# Altium schematic sheet 辉光钟_显示.SchDoc: 辉光钟
size A3; Date: 2016/12/31; CheckedBy: dudu; Author: dudu; Time: 2016/12/31; DocumentName: 辉光钟原理图
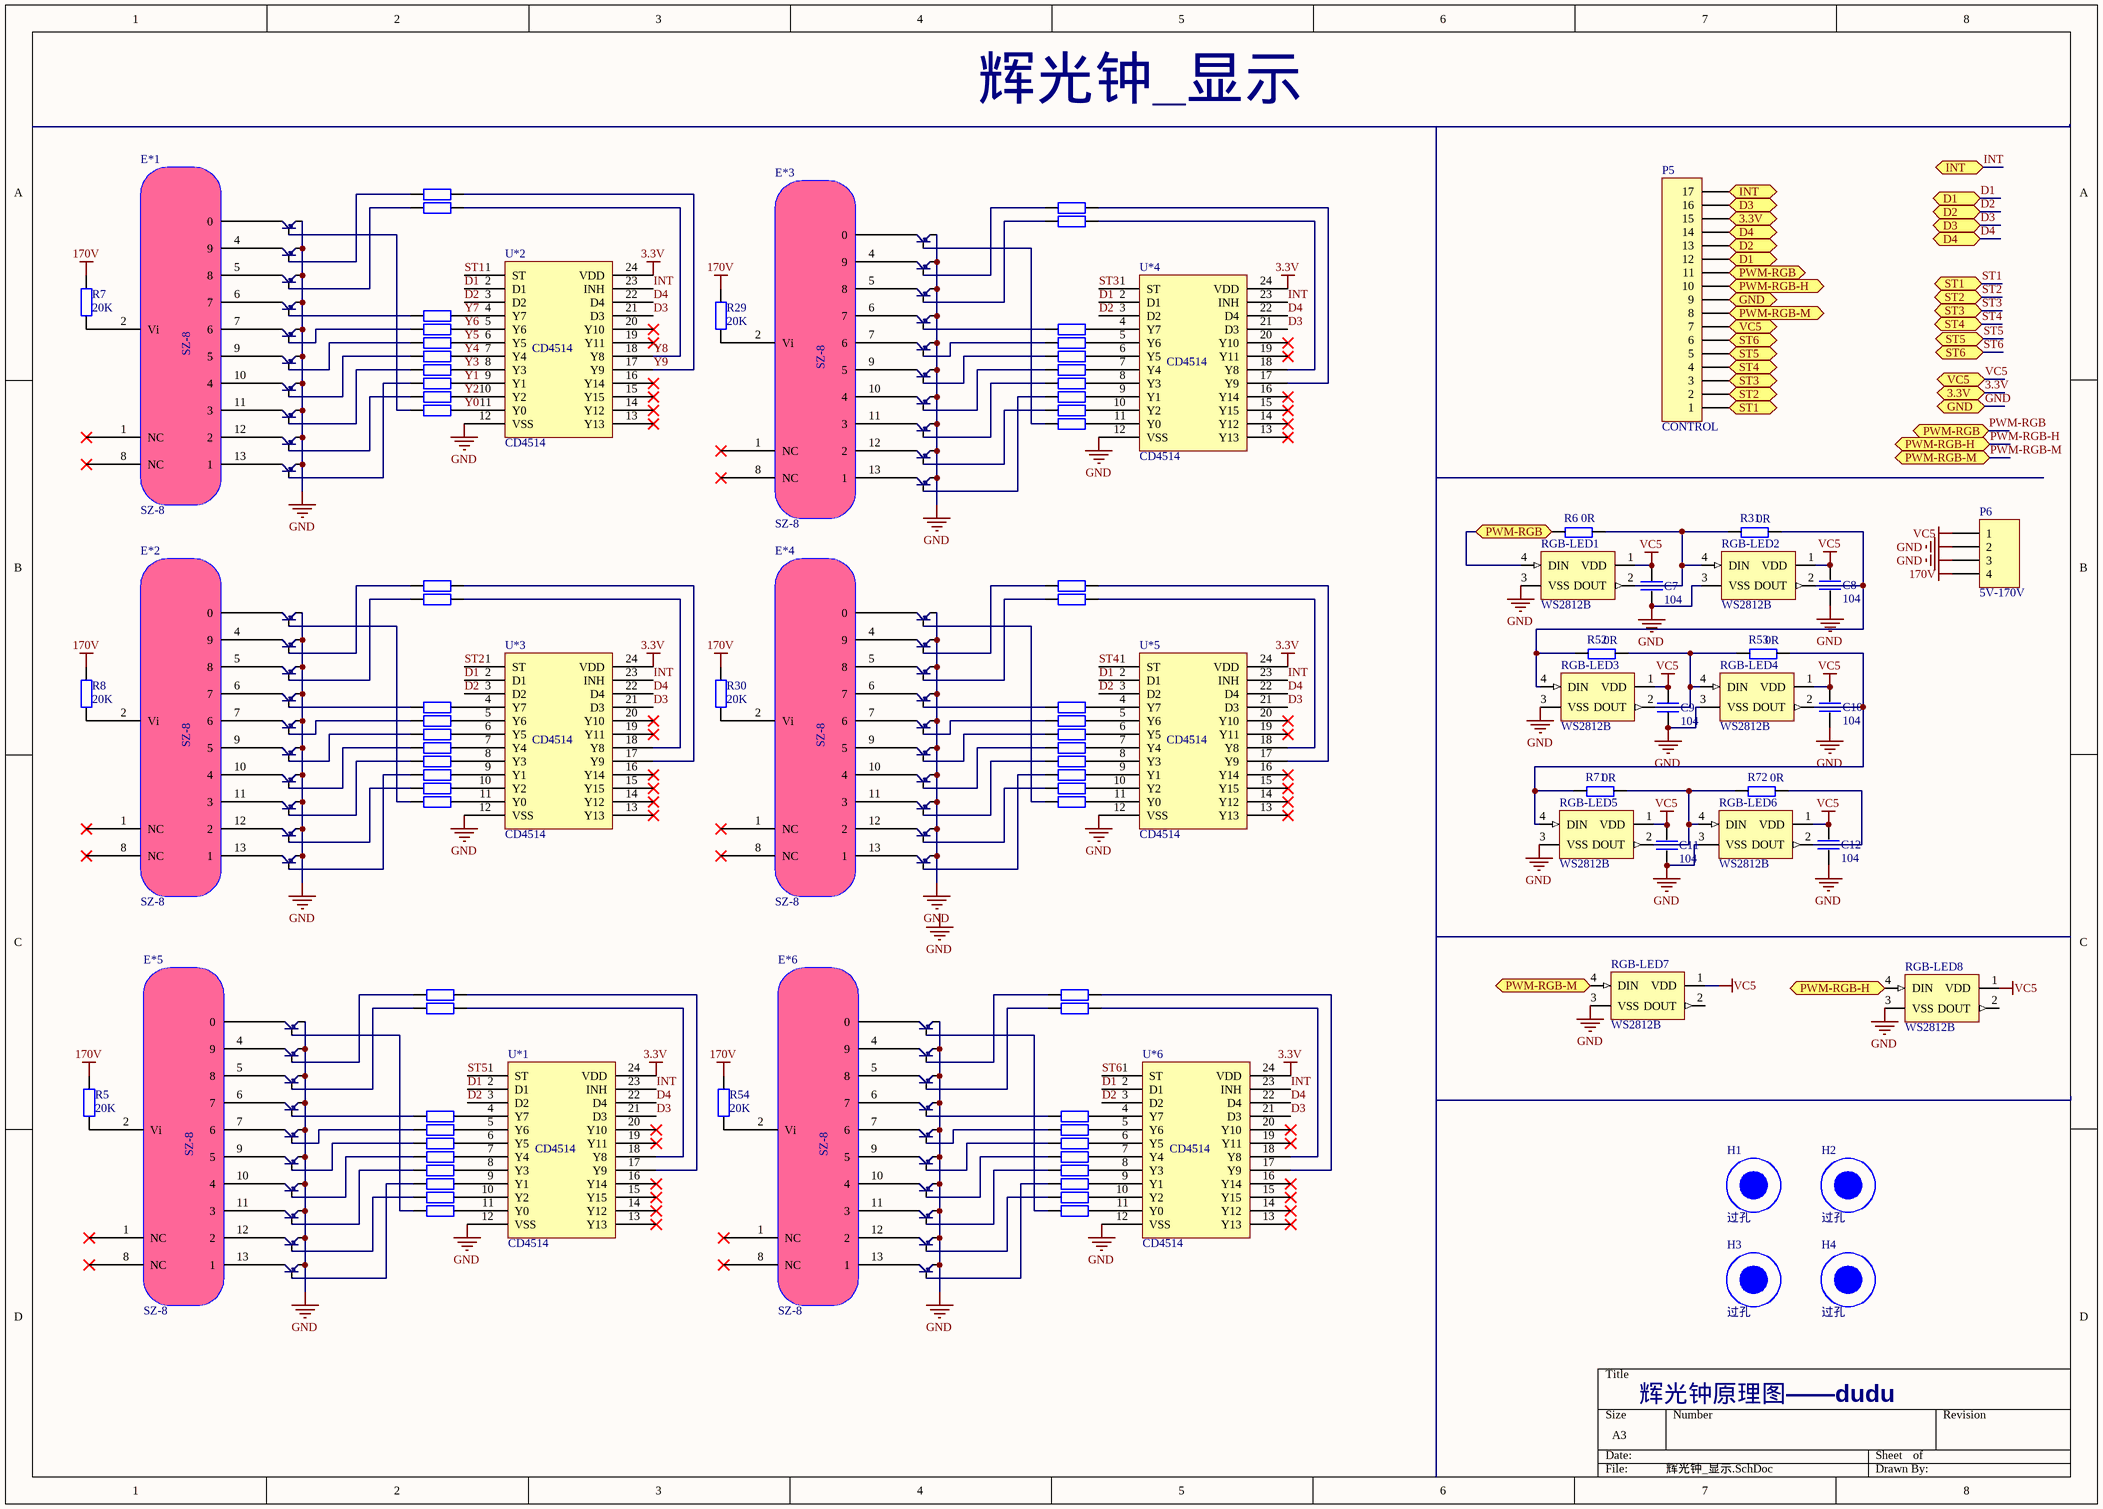
[diagram p0: 辉光钟_显示.SchDoc]

## Parts
C7  104  [0805C]
C8  104  [0805C]
C9  104  [0805C]
C10  104  [0805C]
C11  104  [0805C]
C12  104  [0805C]
E*1  SZ-8  [QS30]
E*2  SZ-8  [QS30]
E*3  SZ-8  [QS30]
E*4  SZ-8  [QS30]
E*5  SZ-8  [QS30]
E*6  SZ-8  [QS30]
H1  过孔  [定位孔]
H2  过孔  [定位孔]
H3  过孔  [定位孔]
H4  过孔  [定位孔]
NPN*1  NPN_mini  [NPN8050 SOT23R]  (value not drawn)
NPN*2  NPN_mini  [NPN8050 SOT23R]  (value not drawn)
NPN*3  NPN_mini  [NPN8050 SOT23R]  (value not drawn)
NPN*4  NPN_mini  [NPN8050 SOT23R]  (value not drawn)
NPN*5  NPN_mini  [NPN8050 SOT23R]  (value not drawn)
NPN*6  NPN_mini  [NPN8050 SOT23R]  (value not drawn)
NPN*7  NPN_mini  [NPN8050 SOT23R]  (value not drawn)
NPN*8  NPN_mini  [NPN8050 SOT23R]  (value not drawn)
NPN*9  NPN_mini  [NPN8050 SOT23R]  (value not drawn)
NPN*10  NPN_mini  [NPN8050 SOT23R]  (value not drawn)
NPN*11  NPN_mini  [NPN8050 SOT23R]  (value not drawn)
NPN*12  NPN_mini  [NPN8050 SOT23R]  (value not drawn)
NPN*13  NPN_mini  [NPN8050 SOT23R]  (value not drawn)
NPN*14  NPN_mini  [NPN8050 SOT23R]  (value not drawn)
NPN*15  NPN_mini  [NPN8050 SOT23R]  (value not drawn)
NPN*16  NPN_mini  [NPN8050 SOT23R]  (value not drawn)
NPN*17  NPN_mini  [NPN8050 SOT23R]  (value not drawn)
NPN*18  NPN_mini  [NPN8050 SOT23R]  (value not drawn)
NPN*19  NPN_mini  [NPN8050 SOT23R]  (value not drawn)
NPN*20  NPN_mini  [NPN8050 SOT23R]  (value not drawn)
NPN*21  NPN_mini  [NPN8050 SOT23R]  (value not drawn)
NPN*22  NPN_mini  [NPN8050 SOT23R]  (value not drawn)
NPN*23  NPN_mini  [NPN8050 SOT23R]  (value not drawn)
NPN*24  NPN_mini  [NPN8050 SOT23R]  (value not drawn)
NPN*25  NPN_mini  [NPN8050 SOT23R]  (value not drawn)
NPN*26  NPN_mini  [NPN8050 SOT23R]  (value not drawn)
NPN*27  NPN_mini  [NPN8050 SOT23R]  (value not drawn)
NPN*28  NPN_mini  [NPN8050 SOT23R]  (value not drawn)
NPN*29  NPN_mini  [NPN8050 SOT23R]  (value not drawn)
NPN*30  NPN_mini  [NPN8050 SOT23R]  (value not drawn)
NPN*31  NPN_mini  [NPN8050 SOT23R]  (value not drawn)
NPN*32  NPN_mini  [NPN8050 SOT23R]  (value not drawn)
NPN*33  NPN_mini  [NPN8050 SOT23R]  (value not drawn)
NPN*34  NPN_mini  [NPN8050 SOT23R]  (value not drawn)
NPN*35  NPN_mini  [NPN8050 SOT23R]  (value not drawn)
NPN*36  NPN_mini  [NPN8050 SOT23R]  (value not drawn)
NPN*37  NPN_mini  [NPN8050 SOT23R]  (value not drawn)
NPN*38  NPN_mini  [NPN8050 SOT23R]  (value not drawn)
NPN*39  NPN_mini  [NPN8050 SOT23R]  (value not drawn)
NPN*40  NPN_mini  [NPN8050 SOT23R]  (value not drawn)
NPN*41  NPN_mini  [NPN8050 SOT23R]  (value not drawn)
NPN*42  NPN_mini  [NPN8050 SOT23R]  (value not drawn)
NPN*43  NPN_mini  [NPN8050 SOT23R]  (value not drawn)
NPN*44  NPN_mini  [NPN8050 SOT23R]  (value not drawn)
NPN*45  NPN_mini  [NPN8050 SOT23R]  (value not drawn)
NPN*46  NPN_mini  [NPN8050 SOT23R]  (value not drawn)
NPN*47  NPN_mini  [NPN8050 SOT23R]  (value not drawn)
NPN*48  NPN_mini  [NPN8050 SOT23R]  (value not drawn)
NPN*49  NPN_mini  [NPN8050 SOT23R]  (value not drawn)
NPN*50  NPN_mini  [NPN8050 SOT23R]  (value not drawn)
NPN*51  NPN_mini  [NPN8050 SOT23R]  (value not drawn)
NPN*52  NPN_mini  [NPN8050 SOT23R]  (value not drawn)
NPN*53  NPN_mini  [NPN8050 SOT23R]  (value not drawn)
NPN*54  NPN_mini  [NPN8050 SOT23R]  (value not drawn)
NPN*55  NPN_mini  [NPN8050 SOT23R]  (value not drawn)
NPN*56  NPN_mini  [NPN8050 SOT23R]  (value not drawn)
NPN*57  NPN_mini  [NPN8050 SOT23R]  (value not drawn)
NPN*58  NPN_mini  [NPN8050 SOT23R]  (value not drawn)
NPN*59  NPN_mini  [NPN8050 SOT23R]  (value not drawn)
NPN*60  NPN_mini  [NPN8050 SOT23R]  (value not drawn)
P5  CONTROL  [LOCAT]
P6  5V-170V  [5V-170V]
R1  Res1  [0603R]  (value not drawn)
R2  Res1  [0603R]  (value not drawn)
R3  Res1  [0603R]  (value not drawn)
R4  Res1  [0603R]  (value not drawn)
R5  value 20K  [0603R]  (hidden comment: Res1)
R6  0R  [0603R]
R7  value 20K  [0603R]  (hidden comment: Res1)
R8  value 20K  [0603R]  (hidden comment: Res1)
R9  Res1  [0603R]  (value not drawn)
R10  Res1  [0603R]  (value not drawn)
R11  Res1  [0603R]  (value not drawn)
R12  Res1  [0603R]  (value not drawn)
R13  Res1  [0603R]  (value not drawn)
R14  Res1  [0603R]  (value not drawn)
R15  Res1  [0603R]  (value not drawn)
R16  Res1  [0603R]  (value not drawn)
R17  Res1  [0603R]  (value not drawn)
R18  Res1  [0603R]  (value not drawn)
R19  Res1  [0603R]  (value not drawn)
R20  Res1  [0603R]  (value not drawn)
R21  Res1  [0603R]  (value not drawn)
R22  Res1  [0603R]  (value not drawn)
R23  Res1  [0603R]  (value not drawn)
R24  Res1  [0603R]  (value not drawn)
R25  Res1  [0603R]  (value not drawn)
R26  Res1  [0603R]  (value not drawn)
R27  Res1  [0603R]  (value not drawn)
R28  Res1  [0603R]  (value not drawn)
R29  value 20K  [0603R]  (hidden comment: Res1)
R30  value 20K  [0603R]  (hidden comment: Res1)
R31  0R  [0603R]
R32  Res1  [0603R]  (value not drawn)
R33  Res1  [0603R]  (value not drawn)
R34  Res1  [0603R]  (value not drawn)
R35  Res1  [0603R]  (value not drawn)
R36  Res1  [0603R]  (value not drawn)
R37  Res1  [0603R]  (value not drawn)
R38  Res1  [0603R]  (value not drawn)
R39  Res1  [0603R]  (value not drawn)
R40  Res1  [0603R]  (value not drawn)
R41  Res1  [0603R]  (value not drawn)
R42  Res1  [0603R]  (value not drawn)
R43  Res1  [0603R]  (value not drawn)
R44  Res1  [0603R]  (value not drawn)
R45  Res1  [0603R]  (value not drawn)
R46  Res1  [0603R]  (value not drawn)
R47  Res1  [0603R]  (value not drawn)
R48  Res1  [0603R]  (value not drawn)
R49  Res1  [0603R]  (value not drawn)
R50  Res1  [0603R]  (value not drawn)
R51  Res1  [0603R]  (value not drawn)
R52  0R  [0603R]
R53  0R  [0603R]
R54  value 20K  [0603R]  (hidden comment: Res1)
R55  Res1  [0603R]  (value not drawn)
R56  Res1  [0603R]  (value not drawn)
R57  Res1  [0603R]  (value not drawn)
R58  Res1  [0603R]  (value not drawn)
R59  Res1  [0603R]  (value not drawn)
R60  Res1  [0603R]  (value not drawn)
R61  Res1  [0603R]  (value not drawn)
R62  Res1  [0603R]  (value not drawn)
R63  Res1  [0603R]  (value not drawn)
R64  Res1  [0603R]  (value not drawn)
R65  Res1  [0603R]  (value not drawn)
R66  Res1  [0603R]  (value not drawn)
R67  Res1  [0603R]  (value not drawn)
R68  Res1  [0603R]  (value not drawn)
R69  Res1  [0603R]  (value not drawn)
R70  Res1  [0603R]  (value not drawn)
R71  0R  [0603R]
R72  0R  [0603R]
RGB-LED1  WS2812B  [WS2812B]
RGB-LED2  WS2812B  [WS2812B]
RGB-LED3  WS2812B  [WS2812B]
RGB-LED4  WS2812B  [WS2812B]
RGB-LED5  WS2812B  [WS2812B]
RGB-LED6  WS2812B  [WS2812B]
RGB-LED7  WS2812B  [WS2812B]
RGB-LED8  WS2812B  [WS2812B]
U*1  CD4514  [SOP24]
U*2  CD4514  [SOP24]
U*3  CD4514  [SOP24]
U*4  CD4514  [SOP24]
U*5  CD4514  [SOP24]
U*6  CD4514  [SOP24]

## Ports
3.3V (bidir), D1 (bidir), D2 (bidir), D3 (bidir), D4 (bidir), GND (bidir), INT (bidir), PWM-RGB (bidir), PWM-RGB-H (bidir), PWM-RGB-M (bidir), ST1 (bidir), ST2 (bidir), ST3 (bidir), ST4 (bidir), ST5 (bidir), ST6 (bidir), VC5 (bidir)

## Nets
3.3V: P5.15 U*1.24(VDD) U*2.24(VDD) U*3.24(VDD) U*4.24(VDD) U*5.24(VDD) U*6.24(VDD) ; port 3.3V
170V: P6.4 R5.2 R7.2 R8.2 R29.2 R30.2 R54.2
GND: C7.1 C8.1 C9.1 C10.1 C11.1 C12.1 NPN*1.2(E) NPN*2.2(E) NPN*3.2(E) NPN*4.2(E) NPN*5.2(E) NPN*6.2(E) NPN*7.2(E) NPN*8.2(E) NPN*9.2(E) NPN*10.2(E) NPN*11.2(E) NPN*12.2(E) NPN*13.2(E) NPN*14.2(E) NPN*15.2(E) NPN*16.2(E) NPN*17.2(E) NPN*18.2(E) NPN*19.2(E) NPN*20.2(E) NPN*21.2(E) NPN*22.2(E) NPN*23.2(E) NPN*24.2(E) NPN*25.2(E) NPN*26.2(E) NPN*27.2(E) NPN*28.2(E) NPN*29.2(E) NPN*30.2(E) NPN*31.2(E) NPN*32.2(E) NPN*33.2(E) NPN*34.2(E) NPN*35.2(E) NPN*36.2(E) NPN*37.2(E) NPN*38.2(E) NPN*39.2(E) NPN*40.2(E) NPN*41.2(E) NPN*42.2(E) NPN*43.2(E) NPN*44.2(E) NPN*45.2(E) NPN*46.2(E) NPN*47.2(E) NPN*48.2(E) NPN*49.2(E) NPN*50.2(E) NPN*51.2(E) NPN*52.2(E) NPN*53.2(E) NPN*54.2(E) NPN*55.2(E) NPN*56.2(E) NPN*57.2(E) NPN*58.2(E) NPN*59.2(E) NPN*60.2(E) P5.9 P6.2 P6.3 RGB-LED1.3(VSS) RGB-LED2.3(VSS) RGB-LED3.3(VSS) RGB-LED4.3(VSS) RGB-LED5.3(VSS) RGB-LED6.3(VSS) RGB-LED7.3(VSS) RGB-LED8.3(VSS) U*1.12(VSS) U*2.12(VSS) U*3.12(VSS) U*4.12(VSS) U*5.12(VSS) U*6.12(VSS) ; port GND
VC5: C7.2 C8.2 C9.2 C10.2 C11.2 C12.2 P5.7 P6.1 RGB-LED1.1(VDD) RGB-LED2.1(VDD) RGB-LED3.1(VDD) RGB-LED4.1(VDD) RGB-LED5.1(VDD) RGB-LED6.1(VDD) RGB-LED7.1(VDD) RGB-LED8.1(VDD) ; port VC5
D1: P5.12 U*1.2(D1) U*2.2(D1) U*3.2(D1) U*4.2(D1) U*5.2(D1) U*6.2(D1) ; port D1
D2: P5.13 U*1.3(D2) U*2.3(D2) U*3.3(D2) U*4.3(D2) U*5.3(D2) U*6.3(D2) ; port D2
D3: P5.16 U*1.21(D3) U*2.21(D3) U*3.21(D3) U*4.21(D3) U*5.21(D3) U*6.21(D3) ; port D3
D4: P5.14 U*1.22(D4) U*2.22(D4) U*3.22(D4) U*4.22(D4) U*5.22(D4) U*6.22(D4) ; port D4
INT: P5.17 U*1.23(INH) U*2.23(INH) U*3.23(INH) U*4.23(INH) U*5.23(INH) U*6.23(INH) ; port INT
PWM-RGB: P5.11 R6.1 RGB-LED1.4(DIN) ; port PWM-RGB
PWM-RGB-H: P5.10 RGB-LED8.4(DIN) ; port PWM-RGB-H
PWM-RGB-M: P5.8 RGB-LED7.4(DIN) ; port PWM-RGB-M
ST1: P5.1 U*2.1(ST) ; port ST1
ST2: P5.2 U*3.1(ST) ; port ST2
ST3: P5.3 U*4.1(ST) ; port ST3
ST4: P5.4 U*5.1(ST) ; port ST4
ST5: P5.5 U*1.1(ST) ; port ST5
ST6: P5.6 U*6.1(ST) ; port ST6
Y0: R18.1 U*2.11(Y0)
Y1: R16.1 U*2.9(Y1)
Y2: R17.1 U*2.10(Y2)
Y3: R15.1 U*2.8(Y3)
Y4: R14.1 U*2.7(Y4)
Y5: R13.1 U*2.6(Y5)
Y6: R12.1 U*2.5(Y6)
Y7: R11.1 U*2.4(Y7)
Y8: R10.1 U*2.18(Y8)
Y9: R9.1 U*2.17(Y9)
NetE*1_2: E*1.2(Vi) R7.1
NetE*1_3: E*1.3(0) NPN*1.3(C)
NetE*1_4: E*1.4(9) NPN*2.3(C)
NetE*1_5: E*1.5(8) NPN*3.3(C)
NetE*1_6: E*1.6(7) NPN*4.3(C)
NetE*1_7: E*1.7(6) NPN*5.3(C)
NetE*1_9: E*1.9(5) NPN*6.3(C)
NetE*1_10: E*1.10(4) NPN*7.3(C)
NetE*1_11: E*1.11(3) NPN*8.3(C)
NetE*1_12: E*1.12(2) NPN*9.3(C)
NetE*1_13: E*1.13(1) NPN*10.3(C)
NetE*2_2: E*2.2(Vi) R8.1
NetE*2_3: E*2.3(0) NPN*11.3(C)
NetE*2_4: E*2.4(9) NPN*12.3(C)
NetE*2_5: E*2.5(8) NPN*13.3(C)
NetE*2_6: E*2.6(7) NPN*14.3(C)
NetE*2_7: E*2.7(6) NPN*15.3(C)
NetE*2_9: E*2.9(5) NPN*16.3(C)
NetE*2_10: E*2.10(4) NPN*17.3(C)
NetE*2_11: E*2.11(3) NPN*18.3(C)
NetE*2_12: E*2.12(2) NPN*19.3(C)
NetE*2_13: E*2.13(1) NPN*20.3(C)
NetE*3_2: E*3.2(Vi) R29.1
NetE*3_3: E*3.3(0) NPN*21.3(C)
NetE*3_4: E*3.4(9) NPN*22.3(C)
NetE*3_5: E*3.5(8) NPN*23.3(C)
NetE*3_6: E*3.6(7) NPN*24.3(C)
NetE*3_7: E*3.7(6) NPN*25.3(C)
NetE*3_9: E*3.9(5) NPN*26.3(C)
NetE*3_10: E*3.10(4) NPN*27.3(C)
NetE*3_11: E*3.11(3) NPN*28.3(C)
NetE*3_12: E*3.12(2) NPN*29.3(C)
NetE*3_13: E*3.13(1) NPN*30.3(C)
NetE*4_2: E*4.2(Vi) R30.1
NetE*4_3: E*4.3(0) NPN*31.3(C)
NetE*4_4: E*4.4(9) NPN*32.3(C)
NetE*4_5: E*4.5(8) NPN*33.3(C)
NetE*4_6: E*4.6(7) NPN*34.3(C)
NetE*4_7: E*4.7(6) NPN*35.3(C)
NetE*4_9: E*4.9(5) NPN*36.3(C)
NetE*4_10: E*4.10(4) NPN*37.3(C)
NetE*4_11: E*4.11(3) NPN*38.3(C)
NetE*4_12: E*4.12(2) NPN*39.3(C)
NetE*4_13: E*4.13(1) NPN*40.3(C)
NetE*5_2: E*5.2(Vi) R5.1
NetE*5_3: E*5.3(0) NPN*41.3(C)
NetE*5_4: E*5.4(9) NPN*43.3(C)
NetE*5_5: E*5.5(8) NPN*45.3(C)
NetE*5_6: E*5.6(7) NPN*47.3(C)
NetE*5_7: E*5.7(6) NPN*49.3(C)
NetE*5_9: E*5.9(5) NPN*51.3(C)
NetE*5_10: E*5.10(4) NPN*53.3(C)
NetE*5_11: E*5.11(3) NPN*55.3(C)
NetE*5_12: E*5.12(2) NPN*57.3(C)
NetE*5_13: E*5.13(1) NPN*59.3(C)
NetE*6_2: E*6.2(Vi) R54.1
NetE*6_3: E*6.3(0) NPN*42.3(C)
NetE*6_4: E*6.4(9) NPN*44.3(C)
NetE*6_5: E*6.5(8) NPN*46.3(C)
NetE*6_6: E*6.6(7) NPN*48.3(C)
NetE*6_7: E*6.7(6) NPN*50.3(C)
NetE*6_9: E*6.9(5) NPN*52.3(C)
NetE*6_10: E*6.10(4) NPN*54.3(C)
NetE*6_11: E*6.11(3) NPN*56.3(C)
NetE*6_12: E*6.12(2) NPN*58.3(C)
NetE*6_13: E*6.13(1) NPN*60.3(C)
NetNPN*1_1: NPN*1.1(B) R18.2
NetNPN*2_1: NPN*2.1(B) R9.2
NetNPN*3_1: NPN*3.1(B) R10.2
NetNPN*4_1: NPN*4.1(B) R11.2
NetNPN*5_1: NPN*5.1(B) R12.2
NetNPN*6_1: NPN*6.1(B) R13.2
NetNPN*7_1: NPN*7.1(B) R14.2
NetNPN*8_1: NPN*8.1(B) R15.2
NetNPN*9_1: NPN*9.1(B) R17.2
NetNPN*10_1: NPN*10.1(B) R16.2
NetNPN*11_1: NPN*11.1(B) R28.2
NetNPN*12_1: NPN*12.1(B) R19.2
NetNPN*13_1: NPN*13.1(B) R20.2
NetNPN*14_1: NPN*14.1(B) R21.2
NetNPN*15_1: NPN*15.1(B) R22.2
NetNPN*16_1: NPN*16.1(B) R23.2
NetNPN*17_1: NPN*17.1(B) R24.2
NetNPN*18_1: NPN*18.1(B) R25.2
NetNPN*19_1: NPN*19.1(B) R27.2
NetNPN*20_1: NPN*20.1(B) R26.2
NetNPN*21_1: NPN*21.1(B) R41.2
NetNPN*22_1: NPN*22.1(B) R32.2
NetNPN*23_1: NPN*23.1(B) R33.2
NetNPN*24_1: NPN*24.1(B) R34.2
NetNPN*25_1: NPN*25.1(B) R35.2
NetNPN*26_1: NPN*26.1(B) R36.2
NetNPN*27_1: NPN*27.1(B) R37.2
NetNPN*28_1: NPN*28.1(B) R38.2
NetNPN*29_1: NPN*29.1(B) R40.2
NetNPN*30_1: NPN*30.1(B) R39.2
NetNPN*31_1: NPN*31.1(B) R51.2
NetNPN*32_1: NPN*32.1(B) R42.2
NetNPN*33_1: NPN*33.1(B) R43.2
NetNPN*34_1: NPN*34.1(B) R44.2
NetNPN*35_1: NPN*35.1(B) R45.2
NetNPN*36_1: NPN*36.1(B) R46.2
NetNPN*37_1: NPN*37.1(B) R47.2
NetNPN*38_1: NPN*38.1(B) R48.2
NetNPN*39_1: NPN*39.1(B) R50.2
NetNPN*40_1: NPN*40.1(B) R49.2
NetNPN*41_1: NPN*41.1(B) R69.2
NetNPN*42_1: NPN*42.1(B) R70.2
NetNPN*43_1: NPN*43.1(B) R1.2
NetNPN*44_1: NPN*44.1(B) R2.2
NetNPN*45_1: NPN*45.1(B) R3.2
NetNPN*46_1: NPN*46.1(B) R4.2
NetNPN*47_1: NPN*47.1(B) R55.2
NetNPN*48_1: NPN*48.1(B) R56.2
NetNPN*49_1: NPN*49.1(B) R57.2
NetNPN*50_1: NPN*50.1(B) R58.2
NetNPN*51_1: NPN*51.1(B) R59.2
NetNPN*52_1: NPN*52.1(B) R60.2
NetNPN*53_1: NPN*53.1(B) R61.2
NetNPN*54_1: NPN*54.1(B) R62.2
NetNPN*55_1: NPN*55.1(B) R63.2
NetNPN*56_1: NPN*56.1(B) R64.2
NetNPN*57_1: NPN*57.1(B) R67.2
NetNPN*58_1: NPN*58.1(B) R68.2
NetNPN*59_1: NPN*59.1(B) R65.2
NetNPN*60_1: NPN*60.1(B) R66.2
NetR1_1: R1.1 U*1.17(Y9)
NetR2_1: R2.1 U*6.17(Y9)
NetR3_1: R3.1 U*1.18(Y8)
NetR4_1: R4.1 U*6.18(Y8)
NetR6_2: R6.2 R31.1 RGB-LED1.2(DOUT) RGB-LED2.4(DIN)
NetR19_1: R19.1 U*3.17(Y9)
NetR20_1: R20.1 U*3.18(Y8)
NetR21_1: R21.1 U*3.4(Y7)
NetR22_1: R22.1 U*3.5(Y6)
NetR23_1: R23.1 U*3.6(Y5)
NetR24_1: R24.1 U*3.7(Y4)
NetR25_1: R25.1 U*3.8(Y3)
NetR26_1: R26.1 U*3.9(Y1)
NetR27_1: R27.1 U*3.10(Y2)
NetR28_1: R28.1 U*3.11(Y0)
NetR31_2: R31.2 R52.1 RGB-LED2.2(DOUT) RGB-LED3.4(DIN)
NetR32_1: R32.1 U*4.17(Y9)
NetR33_1: R33.1 U*4.18(Y8)
NetR34_1: R34.1 U*4.4(Y7)
NetR35_1: R35.1 U*4.5(Y6)
NetR36_1: R36.1 U*4.6(Y5)
NetR37_1: R37.1 U*4.7(Y4)
NetR38_1: R38.1 U*4.8(Y3)
NetR39_1: R39.1 U*4.9(Y1)
NetR40_1: R40.1 U*4.10(Y2)
NetR41_1: R41.1 U*4.11(Y0)
NetR42_1: R42.1 U*5.17(Y9)
NetR43_1: R43.1 U*5.18(Y8)
NetR44_1: R44.1 U*5.4(Y7)
NetR45_1: R45.1 U*5.5(Y6)
NetR46_1: R46.1 U*5.6(Y5)
NetR47_1: R47.1 U*5.7(Y4)
NetR48_1: R48.1 U*5.8(Y3)
NetR49_1: R49.1 U*5.9(Y1)
NetR50_1: R50.1 U*5.10(Y2)
NetR51_1: R51.1 U*5.11(Y0)
NetR52_2: R52.2 R53.1 RGB-LED3.2(DOUT) RGB-LED4.4(DIN)
NetR53_2: R53.2 R71.1 RGB-LED4.2(DOUT) RGB-LED5.4(DIN)
NetR55_1: R55.1 U*1.4(Y7)
NetR56_1: R56.1 U*6.4(Y7)
NetR57_1: R57.1 U*1.5(Y6)
NetR58_1: R58.1 U*6.5(Y6)
NetR59_1: R59.1 U*1.6(Y5)
NetR60_1: R60.1 U*6.6(Y5)
NetR61_1: R61.1 U*1.7(Y4)
NetR62_1: R62.1 U*6.7(Y4)
NetR63_1: R63.1 U*1.8(Y3)
NetR64_1: R64.1 U*6.8(Y3)
NetR65_1: R65.1 U*1.9(Y1)
NetR66_1: R66.1 U*6.9(Y1)
NetR67_1: R67.1 U*1.10(Y2)
NetR68_1: R68.1 U*6.10(Y2)
NetR69_1: R69.1 U*1.11(Y0)
NetR70_1: R70.1 U*6.11(Y0)
NetR71_2: R71.2 R72.1 RGB-LED5.2(DOUT) RGB-LED6.4(DIN)
NetR72_2: R72.2 RGB-LED6.2(DOUT)

Not connected (* = marked no-connect by the designer): E*1 1(NC)* 8(NC)*; E*2 1(NC)* 8(NC)*; E*3 1(NC)* 8(NC)*; E*4 1(NC)* 8(NC)*; E*5 1(NC)* 8(NC)*; E*6 1(NC)* 8(NC)*; RGB-LED7 2(DOUT); RGB-LED8 2(DOUT); U*1 13(Y13)* 14(Y12)* 15(Y15)* 16(Y14)* 19(Y11)* 20(Y10)*; U*2 13(Y13)* 14(Y12)* 15(Y15)* 16(Y14)* 19(Y11)* 20(Y10)*; U*3 13(Y13)* 14(Y12)* 15(Y15)* 16(Y14)* 19(Y11)* 20(Y10)*; U*4 13(Y13)* 14(Y12)* 15(Y15)* 16(Y14)* 19(Y11)* 20(Y10)*; U*5 13(Y13)* 14(Y12)* 15(Y15)* 16(Y14)* 19(Y11)* 20(Y10)*; U*6 13(Y13)* 14(Y12)* 15(Y15)* 16(Y14)* 19(Y11)* 20(Y10)*

## Notes on the sheet
- 辉光钟_显示
- 辉光钟原理图——dudu
- Labels drawn without touching a wire or pin: GND

## Library data of the parts
C7-C12 = C
P5 = Header 17: Header, 17-Pin; LatestRevisionDate: 17-Jul-2002; LatestRevisionNote: Re-released for DXP Platform.; Publisher: Altium Limited
P6 = Header 4: Header, 4-Pin; LatestRevisionDate: 17-Jul-2002; LatestRevisionNote: Re-released for DXP Platform.; Publisher: Altium Limited
R1-R4 R9-R28 R32-R51 R55-R70 = Res1: 贴片电阻; Value: 20K; Published: 8-Jun-2000; LatestRevisionDate: 17-Jul-2002; LatestRevisionNote: Re-released for DXP Platform.; PackageReference: AXIAL-0.4; Publisher: Altium Limited
R5 R7 R8 R29 R30 R54 = Res1: 贴片电阻; Published: 8-Jun-2000; LatestRevisionDate: 17-Jul-2002; LatestRevisionNote: Re-released for DXP Platform.; PackageReference: AXIAL-0.4; Publisher: Altium Limited
R6 R31 R52 R53 R71 R72 = R